# Altium schematic sheet [01] - Power.SchDoc
size A
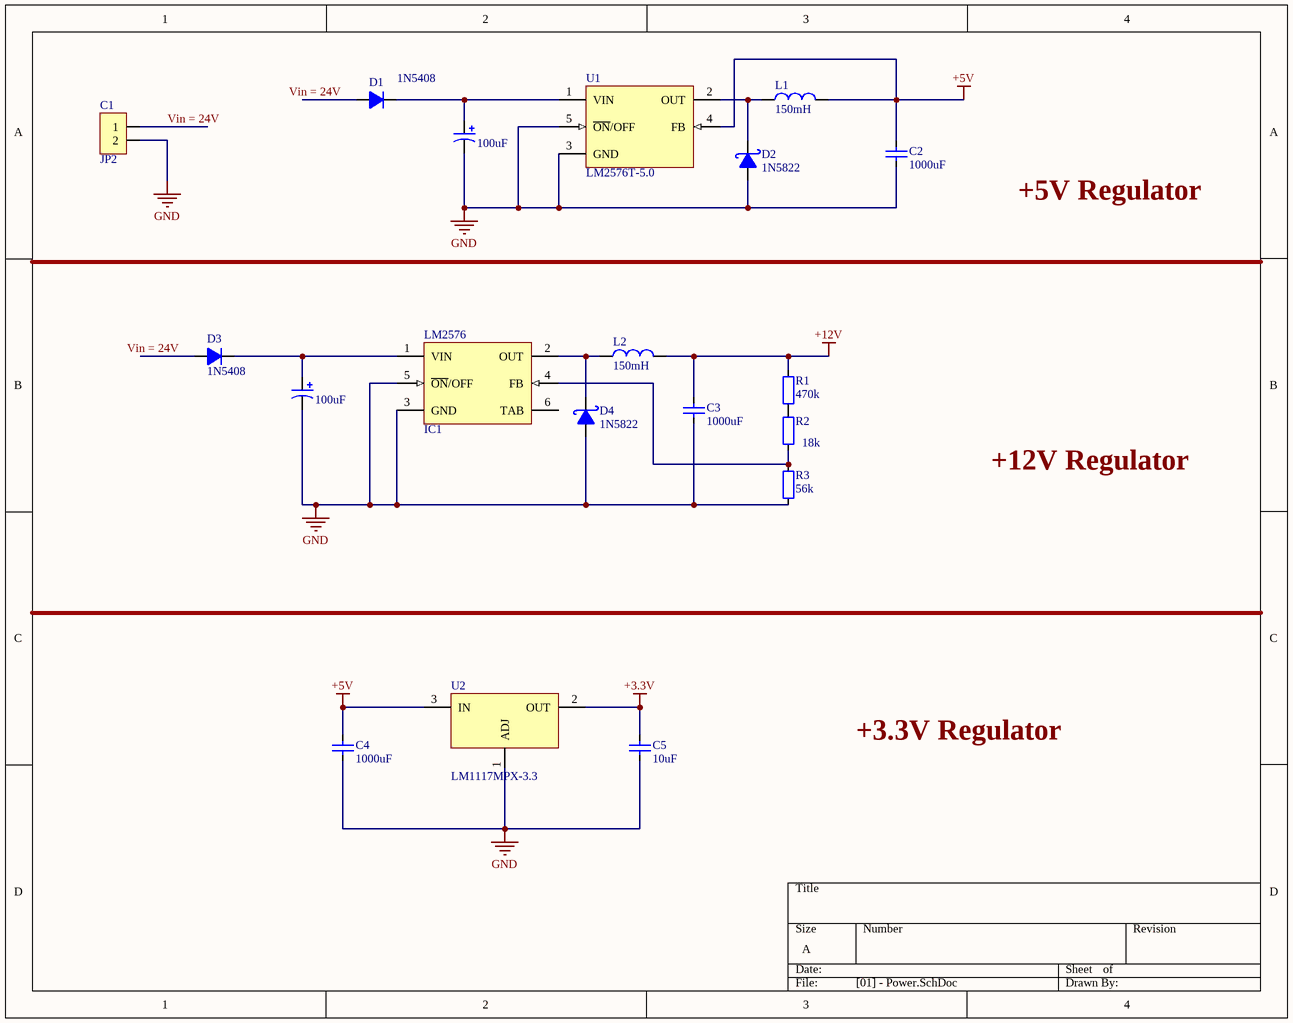
[diagram p0: [01] - Power.SchDoc]

## Parts
(Parts that share a designator on the sheet are numbered #1, #2 ... from top to bottom, then left to right.)
100uF#1  CAP_TAN_SMD  [CAP_7343]  (value not drawn)
100uF#2  CAP_TAN_SMD  [CAP_7343]  (value not drawn)
C1  JP2  [JP2-C1T]
C2  1000uF  [CAP_0402]
C3  1000uF  [CAP_0402]
C4  1000uF  [CAP_0402]
C5  10uF  [CAP_0402]
D1  1N5408  [D5A]
D2  1N5822  [D5A]
D3  1N5408  [D5A]
D4  1N5822  [D5A]
IC1  LM2576  [TS5B_N]
L1  150mH  [L/0.4]
L2  150mH  [L/0.4]
R1  470k  [RES-SMD-0805]
R2  18k  [RES-SMD-0805]
R3  56k  [RES-SMD-0805]
U1  LM2576T-5.0  [LM2576t]
U2  LM1117MPX-3.3  [LM1117-SOP]

## Nets
+3.3V: C5.2 U2.2(OUT)
+5V: C2.2 C4.2 L1.2 U1.4(FB) U2.3(IN)
+12V: C3.2 L2.2 R1.2
GND: 100uF#1.2 100uF#2.2 C1.2 C2.1 C3.1 C4.1 C5.1 D2.1(A) D4.1(A) IC1.3(GND) IC1.5(~{ON}/OFF) R3.1 U1.3(GND) U1.5(~{ON}/OFF) U2.1(ADJ)
Vin = 24V: C1.1
Net100uF#1_1: 100uF#1.1 D1.2(K) U1.1(VIN)
Net100uF#2_1: 100uF#2.1 D3.2(K) IC1.1(VIN)
NetD2_2: D2.2(K) L1.1 U1.2(OUT)
NetD4_2: D4.2(K) IC1.2(OUT) L2.1
NetIC1_4: IC1.4(FB) R2.1 R3.2
NetR1_1: R1.1 R2.2

Not connected (* = marked no-connect by the designer): D1 1(A); D3 1(A); IC1 6(TAB)

## Notes on the sheet
- Labels drawn without touching a wire or pin: +3.3V Regulator, +5V Regulator, +12V Regulator, Vin = 24V

## Library data of the parts
100uF#1 100uF#2 = CAP_TAN_SMD: Polazied Tantalum Capacitor
C1 = JP2: WR-PHD 2.54 mm Angled Socket Header; Manufacturer: W¨¹rth Elektronik eiSos GmbH; partNo: 613002143121; ComponentLink1 Description: Manufacturer; ComponentLink2 Description: Datasheet; NoPins: 02; Created Date: 29 March 2013; ComponentLink1URL: http://www.we-online.com; ComponentLink2URL: http://katalog.we-online.de/em/datasheet/6130xx143121.pdf; Created by: Karrer Zheng
C2-C5 = CapSMD: Capacitor; Value: 33p; Published: 8-Jun-2000; LatestRevisionDate: 17-Jul-2002; LatestRevisionNote: Re-released for DXP Platform.; PackageReference: RAD-0.3; Publisher: Altium Limited
D1 D3 = D5A: Diode 5A; Value: 1N5408
D2 D4 = 1N5822: Schottky Rectifiers; Value: Diode c?m 1N5408
L1 L2 = Inductor: Value: 150 mH
R1-R3 = Resistor - SMD: Resistor; Manufacturer: Generic Components; Class: Passive; Published: 08/06/2000; Publisher: Altium Hobart Technology Centre
U1 = LM2576T-5.0: SIMPLE SWITCHER; 3A Step-Down Voltage Regulator; Manufacturer: National Semiconductor; PackageTopMarking: NSUZXYTT*LM2576T*-5.0 P+; PowerWise: N; FirstPublished: 4-Dec-2008; DatasheetVersion: Aug-2004; PackageVersion: revJ, Jan-1992; PackageReference: T05A; Publisher: Altium Limited; PackageDescription: TO-220, Molded, 5 Lead, Straight; CompType: Switcher; PartNumber: LM2576T-5.0; RoHS: O; PinCount: 5; DigiKeyPartNumber: LM2576T-5.0-ND; Code_JEDEC: TO-220-AB; ComponentLink1Description: LM2576 Datasheet; ComponentLink1URL: http://www.national.com/ds/LM/LM2576.pdf; ComponentLink2Description: LM2576 Web Page; ComponentLink2URL: http://www.national.com/pf/LM/LM2576.html; ComponentLink3Description: T05A Package Page; ComponentLink3URL: http://www.national.com/packaging/folders/t05a.html
U2 = LM1117-ADJ: 800mA Low-Dropout Linear Regulator; Creator: Nguyen Ba Bien; Website: http://group3i.net